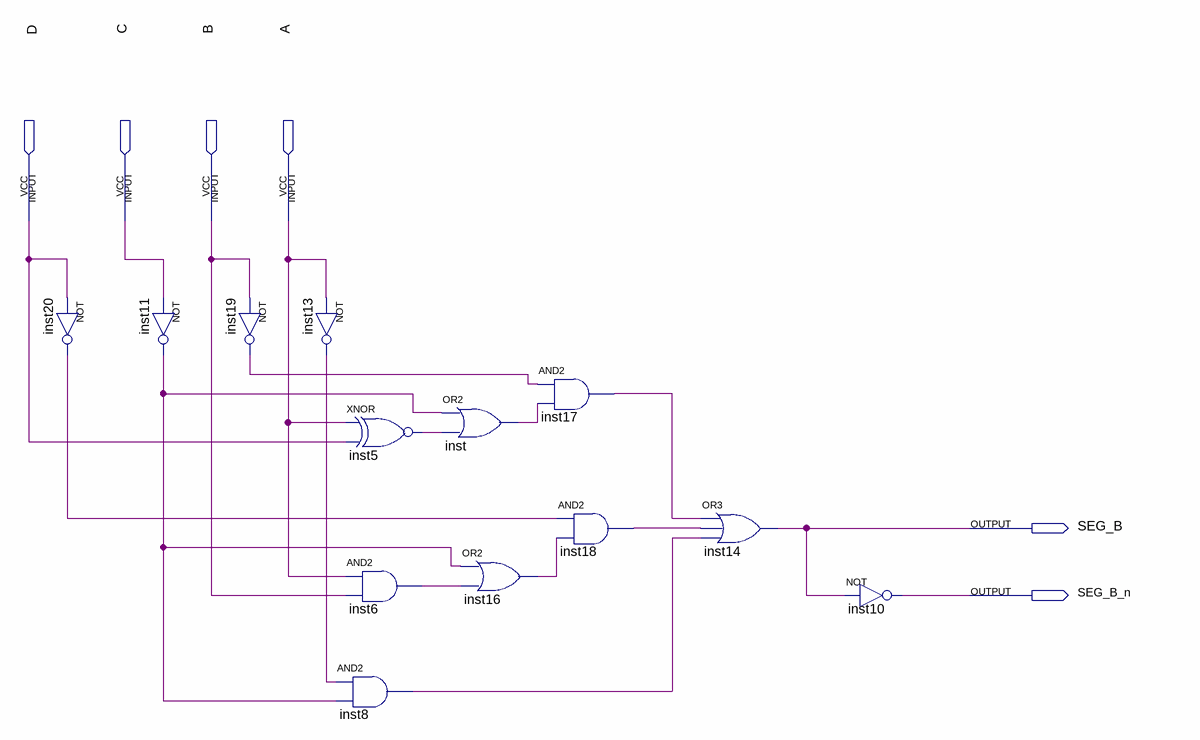
[diagram p0: schematic sheet]
// Quartus schematic SEG_B.bdf as structural Verilog: 13 symbols, 6 pins
module SEG_B (
  input  D,
  input  C,
  input  B,
  input  A,
  output SEG_B,
  output SEG_B_n
);

  wire inst5_out, inst6_out, inst8_out, inst11_out, inst13_out, inst16_out, inst17_out, inst18_out,
       inst19_out, inst20_out, inst_out;

  not inst20 (inst20_out, D);
  not inst11 (inst11_out, C);
  not inst19 (inst19_out, B);
  not inst13 (inst13_out, A);
  xnor inst5 (inst5_out, A, D);
  and inst6 (inst6_out, A, B);
  and inst8 (inst8_out, inst13_out, inst11_out);
  or inst (inst_out, inst11_out, inst5_out);
  or inst16 (inst16_out, inst11_out, inst6_out);
  and inst17 (inst17_out, inst19_out, inst_out);
  and inst18 (inst18_out, inst20_out, inst16_out);
  or inst14 (SEG_B, inst17_out, inst18_out, inst8_out);
  not inst10 (SEG_B_n, SEG_B);
endmodule
